# Altium schematic sheet bee_hive_2.SchDoc
size A4
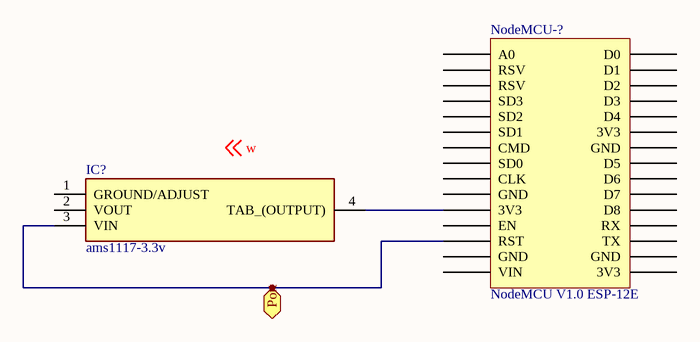
[diagram p0: bee_hive_2.SchDoc]

## Parts
IC?  ams1117-3.3v  [SOT229P700X180-4N]
NodeMCU-?  NodeMCU V1.0 ESP-12E  [NodeMCU V1.0 ESP-12E]

## Ports
Port (bidir)

## Nets
Port: IC?.3(VIN) NodeMCU-?.RST ; port Port
NetIC?_4: IC?.4(TAB_(OUTPUT)) NodeMCU-?.3V3

Not connected (* = marked no-connect by the designer): IC? 1(GROUND/ADJUST) 2(VOUT); NodeMCU-? A0 CLK CMD D0 D1 D2 D3 D4 D5 D6 D7 D8 EN GND RSV RX SD0 SD1 SD2 SD3 TX VIN

## Notes on the sheet
- Labels drawn without touching a wire or pin: w

## Library data of the parts
IC? = ams1117-3.3v: Integrated Circuit; Manufacturer_Name: Advanced Monolithic Systems; Datasheet Link: http://www.advanced-monolithic.com/pdf/ds1117.pdf; Height: 1.8mm; Manufacturer_Part_Number: ams1117-3.3v
NodeMCU-? = NodeMCU V1.0 ESP-12E: NodeMCU V1.0 ESP8266 (ESP-12E)